# Altium schematic sheet 007_Ethernet.SchDoc: =title_line_1 + title_line_2
size 420 x 297 mm; SheetNumber: 7
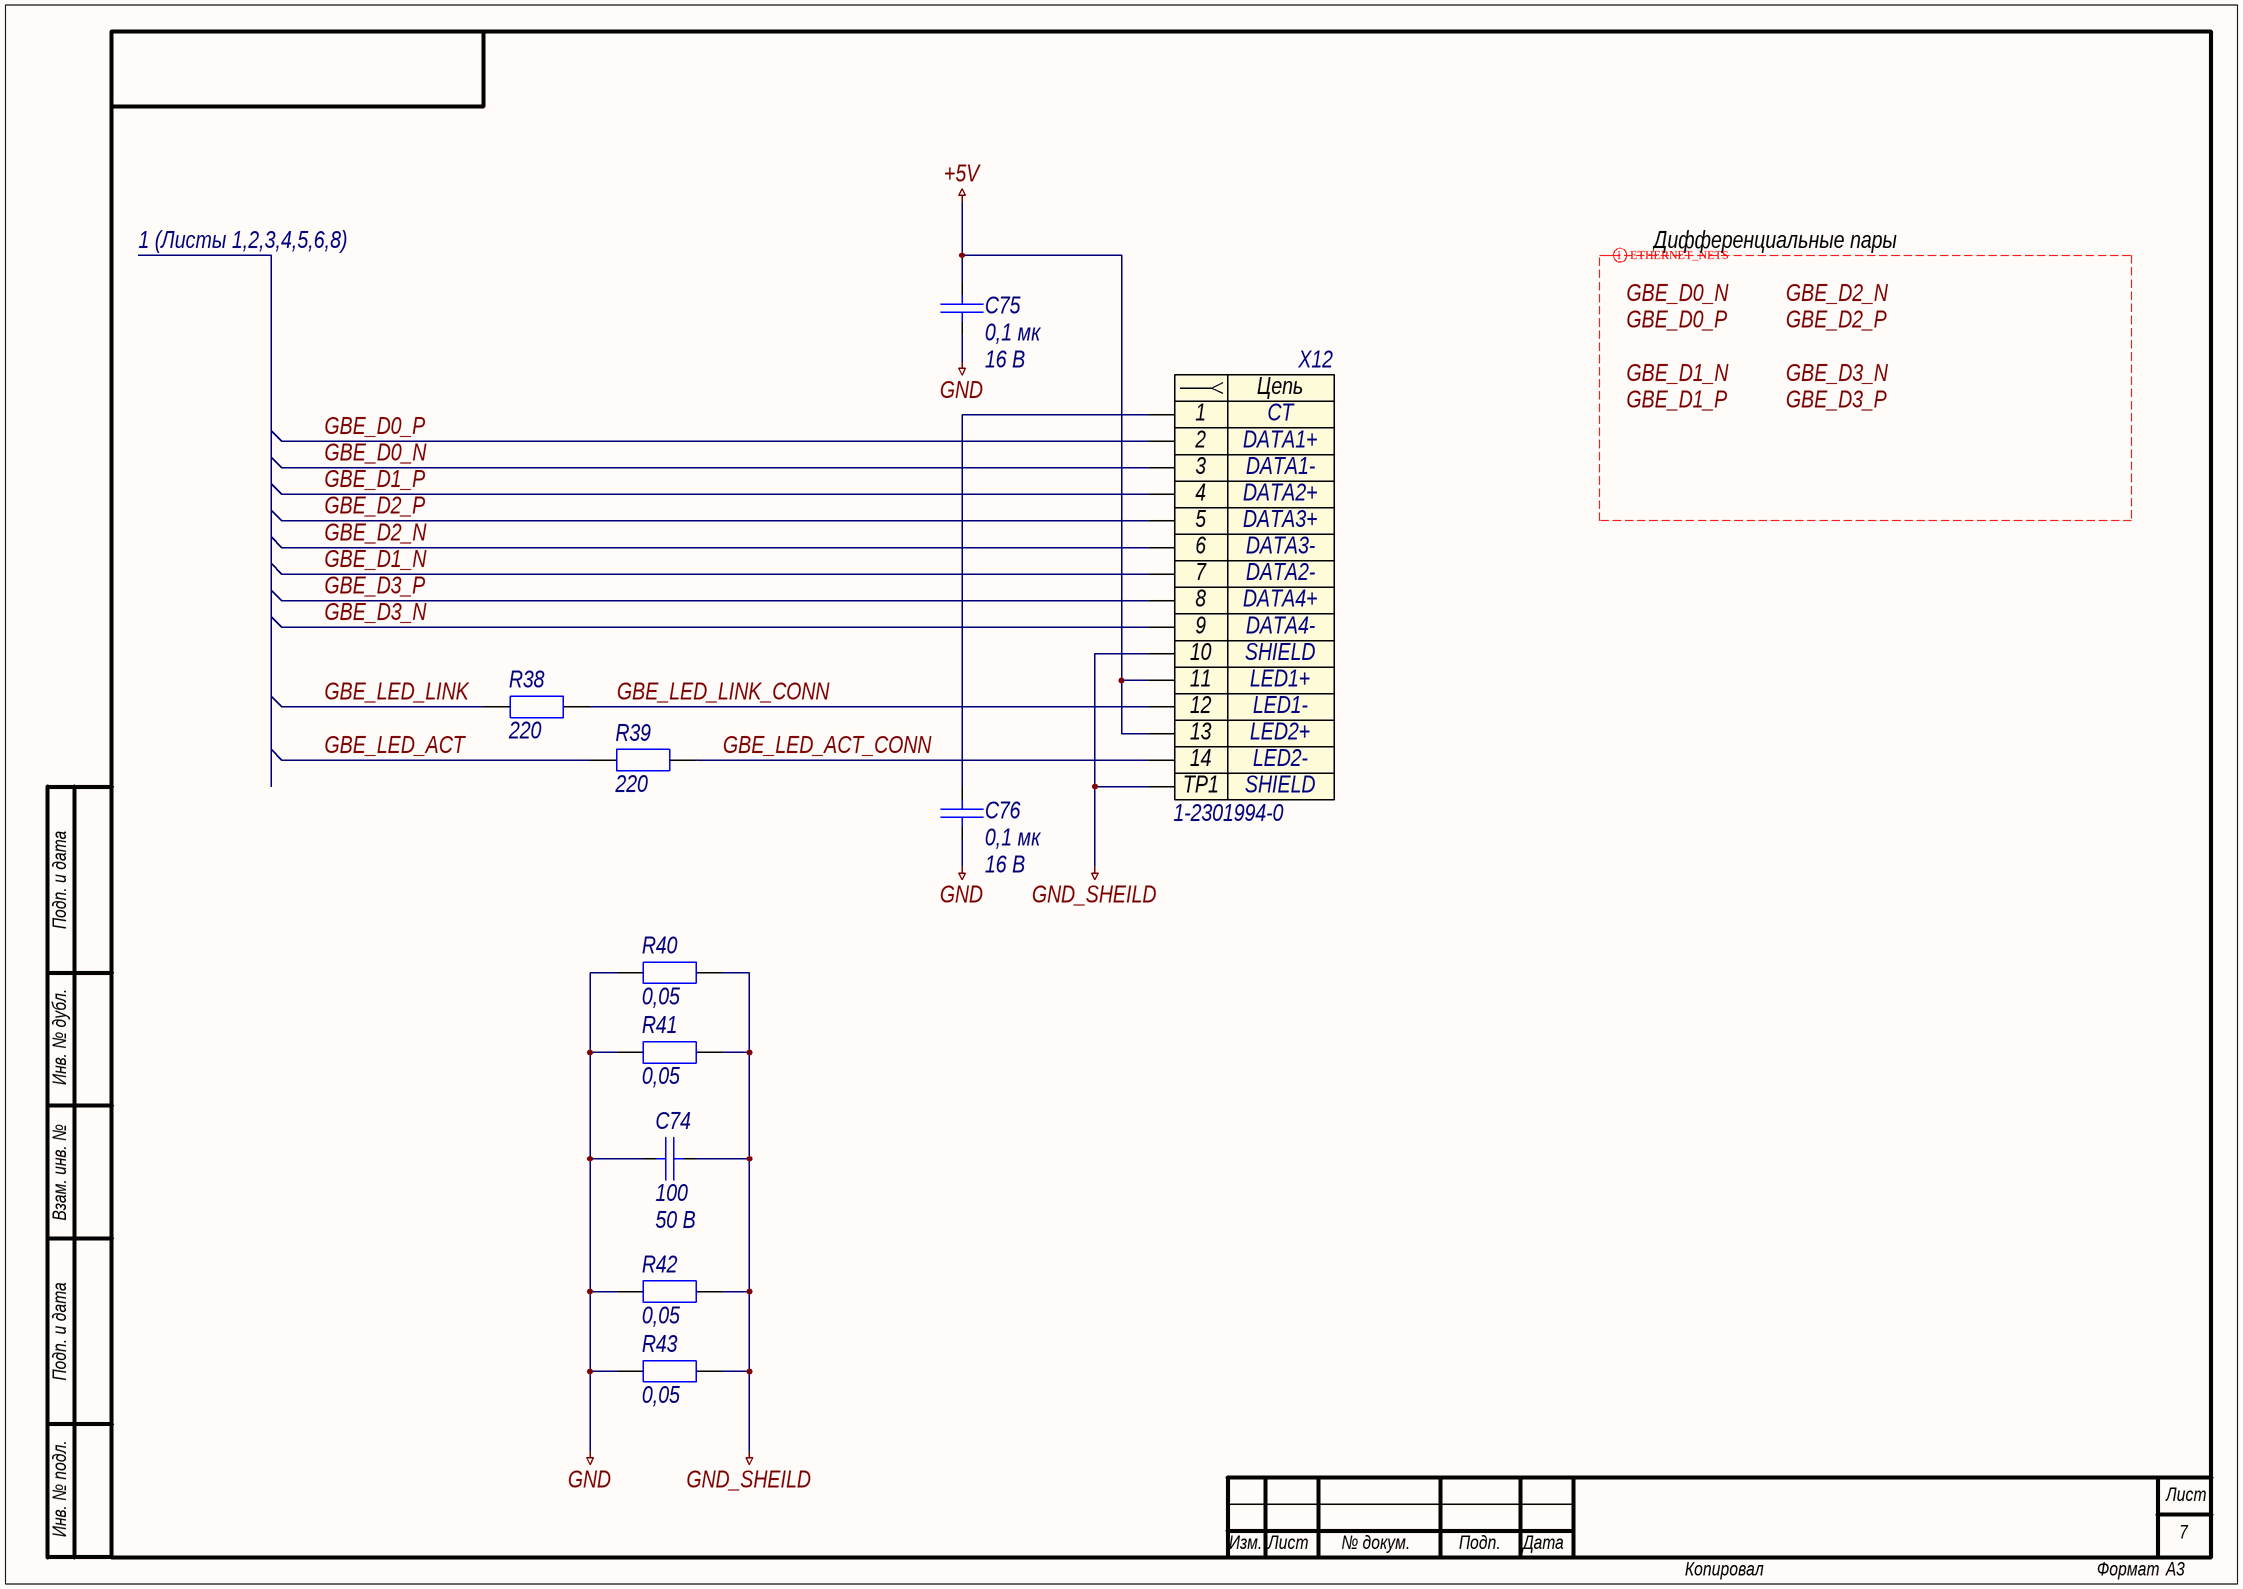
[diagram p0: 007_Ethernet.SchDoc]

## Parts
C74  100  Напряжение: 50 В  [C0402]
C75  0,1 мк  Напряжение: 16 В  [C0603]
C76  0,1 мк  Напряжение: 16 В  [C0603]
R38  220  [R0603]
R39  220  [R0603]
R40  0,05  [R0603]
R41  0,05  [R0603]
R42  0,05  [R0603]
R43  0,05  [R0603]
X12  1-2301994-0  [1-2301994-0]

## Nets
+5V: C75.1 X12.11 X12.13
GND: C74.2 C75.2 C76.2 R40.1 R41.1 R42.1 R43.1
GND_SHEILD: C74.1 R40.2 R41.2 R42.2 R43.2 X12.10 X12.TP1
GBE_D0_N: X12.3
GBE_D0_P: X12.2
GBE_D1_N: X12.7
GBE_D1_P: X12.4
GBE_D2_N: X12.6
GBE_D2_P: X12.5
GBE_D3_N: X12.9
GBE_D3_P: X12.8
GBE_LED_ACT: R39.1
GBE_LED_ACT_CONN: R39.2 X12.14
GBE_LED_LINK: R38.1
GBE_LED_LINK_CONN: R38.2 X12.12
NetC76_1: C76.1 X12.1

## Layout directives
differential pair; rule Differential Pairs Routing [Pref Gap = 0.3mm    Min Gap  = 0.15mm    Max Gap  = 0.3mmPref Width = 0.126mm    Min Width  = 0.126mm    Max Width  = 0.155mm]; differential pair class ETHERNET_SIGNALS: GBE_D0_N, GBE_D0_P, GBE_D1_N, GBE_D1_P, GBE_D2_N, GBE_D2_P, GBE_D3_N, GBE_D3_P

## Notes on the sheet
- 1 (Листы 1,2,3,4,5,6,8)
- Дифференциальные пары
- Labels drawn without touching a wire or pin: GBE_D0_N, GBE_D0_P, GBE_D1_N, GBE_D1_P, GBE_D2_N, GBE_D2_P, GBE_D3_N, GBE_D3_P
- Подп. и дата
- Инв. № дубл.
- Взам. инв. №
- Инв. № подл.
- Лист
- Изм.
- № докум.
- Подп.
- Дата
- Копировал
- Формат
- А3
- (in symbol x0016) Цепь

## Library data of the parts
C74 = c0004: =Описание; ID: c0004; Фамилия: Ларионов; Описание: Конденсатор керамический чип 0402 100 пФ 50 В ±1 %; Наименование: CL05C101FB5NNNC; Производитель: Samsung Electro-Mechanics; Отклонение: ±1 %; Рабочие температуры: от –55 °С до +125 °С; Температурный коэффициент емкости: C0G; Корпус: 0402; Номинал: 100; Номинальное напряжение: 50 В; HelpURL: http://product.samsungsem.com/mlcc/CL05C101FB5NNN.do
C75 C76 = c0081: =Описание; ID: c0081; Фамилия: Паньков; Описание: Конденсатор керамический чип 0603 100 нФ 16 В ±10 %; Наименование: CC0603KRX7R7BB104; Производитель: YAGEO Corp.; Отклонение: ±10 %; Рабочие температуры: от –55 °С до +125 °С; Температурный коэффициент емкости: X7R; Корпус: 0603; Номинал: 0,1 мк; Номинальное напряжение: 16 В; HelpURL: https://www.yageo.com/upload/media/product/productsearch/datasheet/mlcc/UPY-GPHC_X7R_6.3V-to-50V_20.pdf
R38 R39 = r0060: =Описание; ID: r0060; Фамилия: Ларионов; Описание: Резистор чип 0603 220 Ом ±1 % 0,1 Вт; Наименование: RC0603FR-07220RL; Производитель: YAGEO Corp.; Отклонение: ±1 %; Номинальное напряжение: 75 В; Номинальный ток: 1 А; Рабочие температуры: от –55 °С до +155 °С; Корпус: 0603; Примечание: Ряд E24; Номинал: 220; HelpURL: https://www.yageo.com/upload/media/product/productsearch/datasheet/rchip/PYu-RC_Group_51_RoHS_L_11.pdf
R40-R43 = r0002: =Описание; ID: r0002; Фамилия: Ларионов; Описание: Резистор чип 0603 50 мОм ±1 % 0,1 Вт; Наименование: RL0603FR-070R05L; Производитель: YAGEO Corp.; Отклонение: ±1 %; Номинальное напряжение: не указано; Номинальный ток: 2 А; Рабочие температуры: от –55 °С до +155 °С; Корпус: 0603; Номинал: 0,05; HelpURL: https://www.yageo.com/upload/media/product/productsearch/datasheet/rchip/PYu-RL_Group_521_RoHS_L_2.pdf
X12 = x0016: =Описание; Contact_1: CT; Contact_2: DATA1+; Contact_3: DATA1-; Contact_4: DATA2+; Contact_5: DATA3+; Contact_6: DATA3-; Contact_7: DATA2-; Contact_8: DATA4+; Contact_9: DATA4-; Contact_10: SHIELD; Contact_11: LED1+; Contact_12: LED1-; Contact_13: LED2+; Contact_14: LED2-; ID: x0016; Фамилия: Ларионов; Описание: RJ45 интегрированный трансформатор 1 Gbps LED гнездо угловой; Производитель: TE Connectivity; TP1: SHIELD; Наименование: 1-2301994-0; HelpURL: https://www.te.com/usa-en/product-1-2301994-0.html?source=header-match